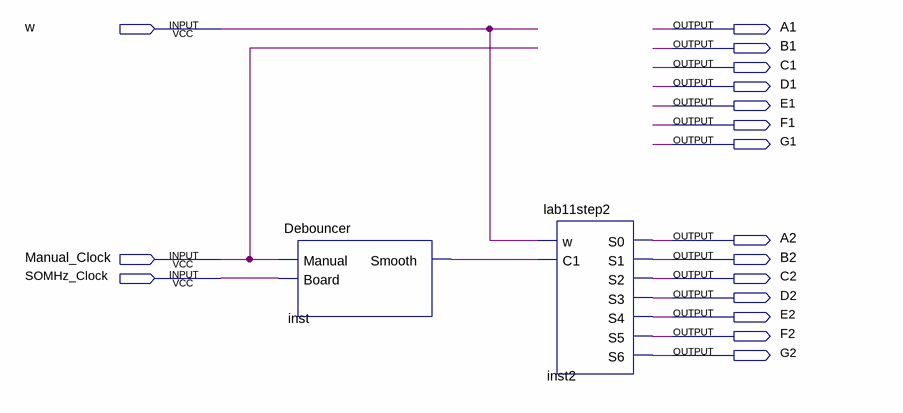
[diagram p0: schematic sheet]
// Quartus schematic lab11step3.bdf as structural Verilog: 2 symbols, 17 pins
module lab11step3 (
  input  w,
  input  Manual_Clock,
  input  SOMHz_Clock,
  output A1,
  output B1,
  output C1,
  output D1,
  output E1,
  output F1,
  output G1,
  output A2,
  output B2,
  output C2,
  output D2,
  output E2,
  output F2,
  output G2
);

  wire inst_smooth;

  Debouncer inst (.Manual(Manual_Clock), .Board(SOMHz_Clock), .Smooth(inst_smooth));
  lab11step2 inst2 (.w(w), .C1(inst_smooth), .S0(A2), .S1(B2), .S2(C2), .S3(D2), .S4(E2), .S5(F2), .S6(G2));
endmodule
